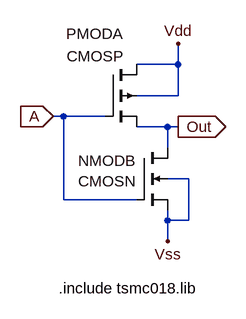
[diagram p0: schematic NOT1.asc]
NOT1.asc, the LTspice schematic file:
Version 4
SHEET 1 880 680
WIRE 288 -96 288 -128
WIRE 288 -96 224 -96
WIRE 288 -48 288 -96
WIRE 288 -48 224 -48
WIRE 112 -16 96 -16
WIRE 176 -16 112 -16
WIRE 272 0 224 0
WIRE 288 0 272 0
WIRE 272 32 272 0
WIRE 304 80 272 80
WIRE 112 112 112 -16
WIRE 224 112 112 112
WIRE 272 144 272 128
WIRE 304 144 304 80
WIRE 304 144 272 144
WIRE 272 176 272 144
FLAG 96 -16 A
IOPIN 96 -16 In
FLAG 288 0 Out
IOPIN 288 0 Out
FLAG 272 176 Vss
FLAG 288 -128 Vdd
SYMBOL pmos4 176 -96 R0
WINDOW 0 -60 -47 Left 2
WINDOW 3 -59 -13 Left 2
SYMATTR InstName PMODA
SYMATTR Value CMOSP
SYMATTR Value2 l=1u w=2u
SYMBOL nmos4 224 32 R0
WINDOW 0 -90 20 Left 2
WINDOW 3 -90 52 Left 2
SYMATTR InstName NMODB
SYMATTR Value CMOSN
SYMATTR Value2 l=1u w=1u
TEXT 104 248 Left 2 !.include tsmc018.lib

The netlist it stands for:
* NOT1.asc
M§PMODA Vdd A Out Vdd CMOSP l=1u w=2u
M§NMODB Out A Vss Vss CMOSN l=1u w=1u
.model NMOS NMOS
.model PMOS PMOS
.lib standard.mos
.include tsmc018.lib
.backanno
.end